# EAGLE design Lapse controller mini, Rev2 (EAGLE 9.4.2)
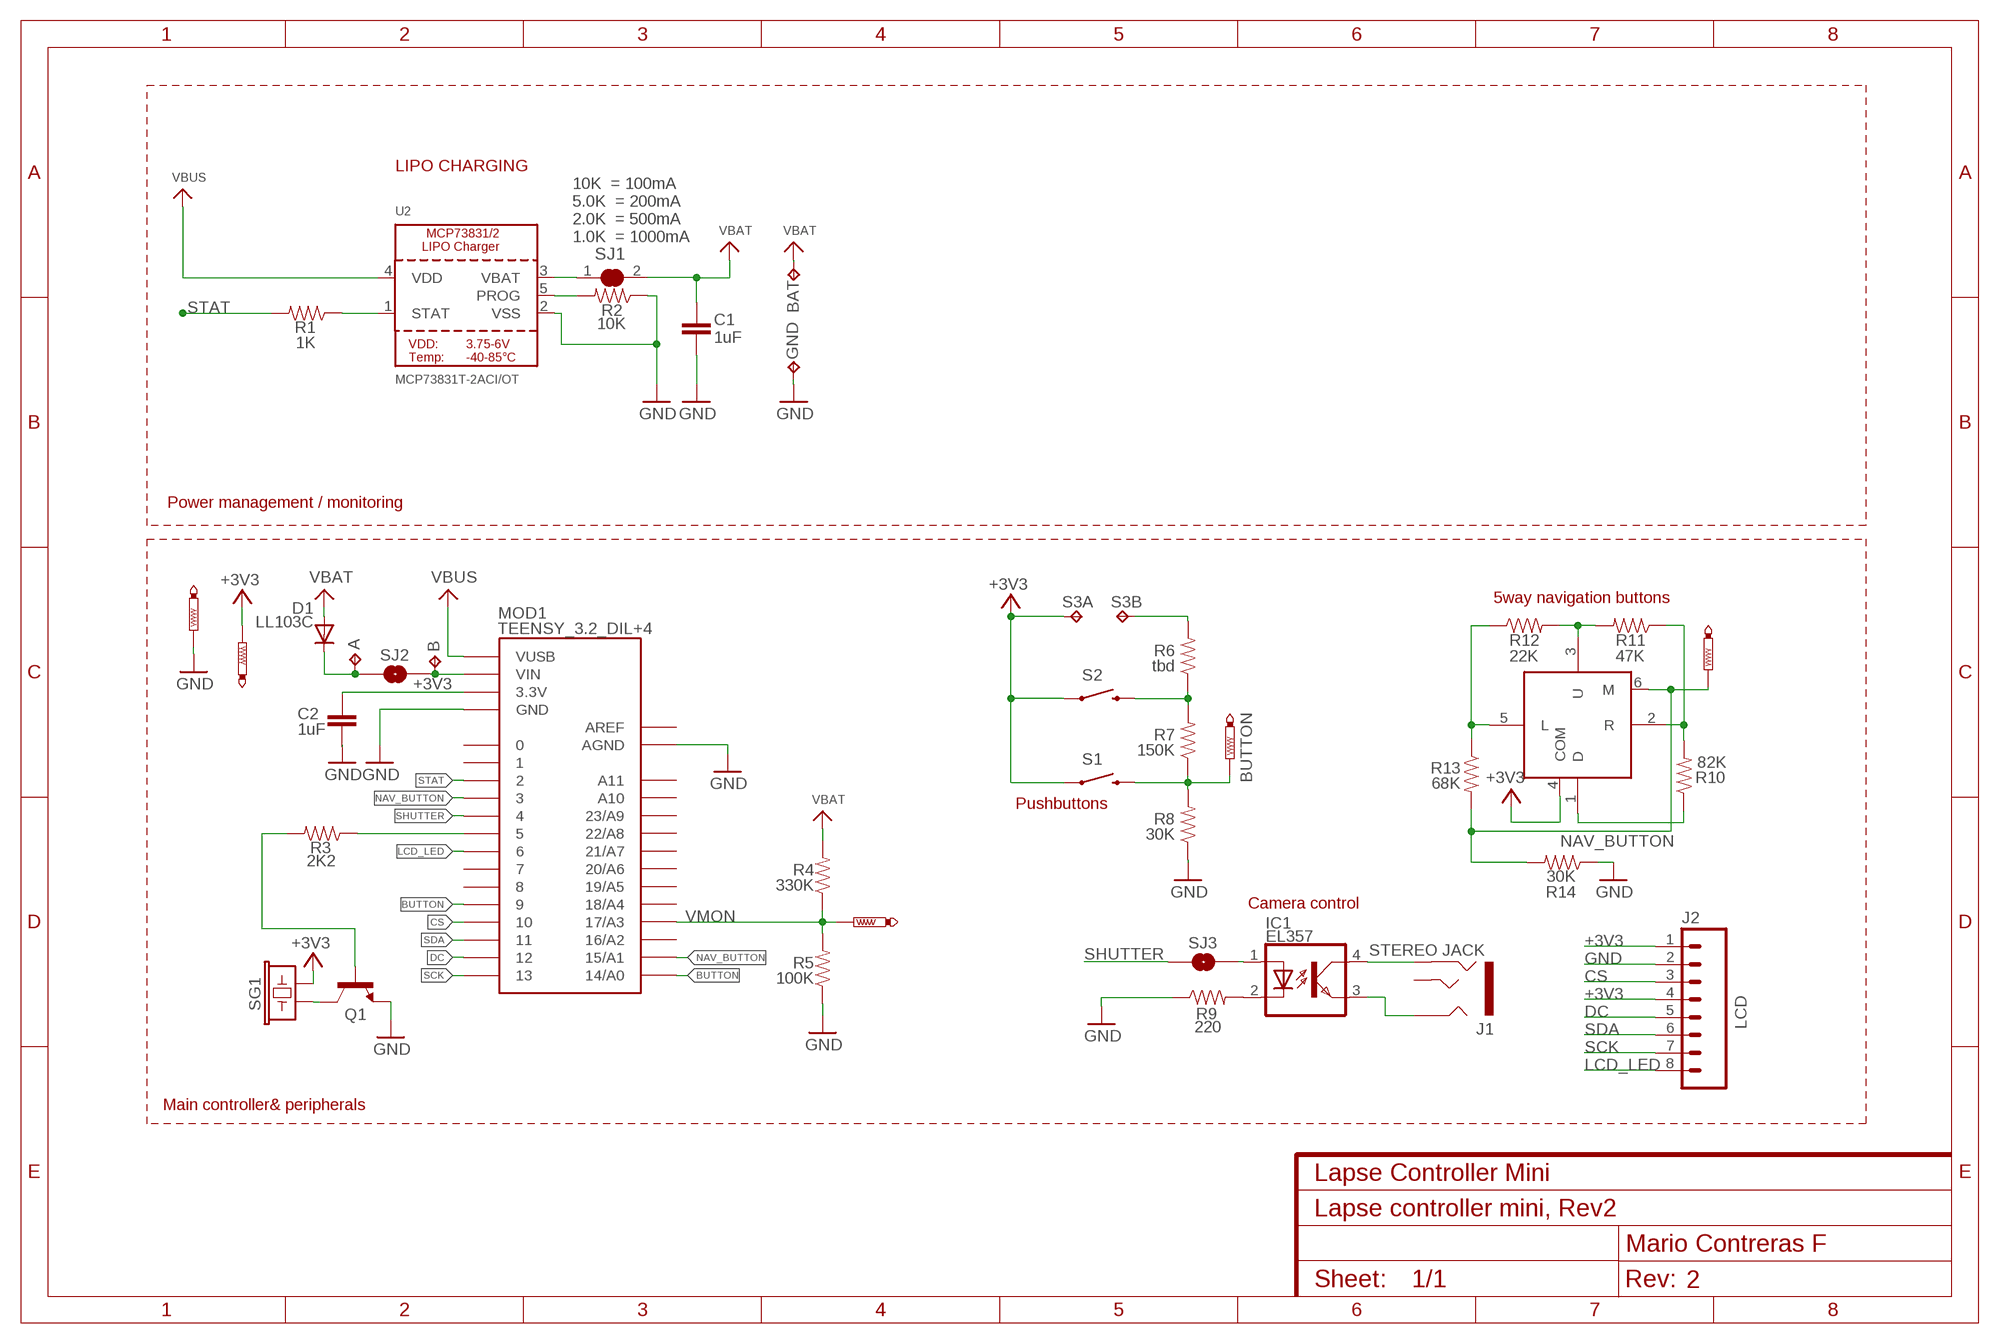
[diagram p0: schematic, sheet 1]
FRAME1 (FRAME-A4L): CNAME: Lapse Controller Mini; CREVISION: 2; DESIGNER: Mario Contreras F

## Parts
3V3  PTR1PAD1-13  [P1-13]
A  TPTP17SQ  [TP17SQ]
B  TPTP17SQ  [TP17SQ]
BAT  VBAT  TPPAD1_B  [P1-PAD_B]
BTN  PTR1PAD1-13  [P1-13]
BUTTONS1  GND  PTR1PAD1-13  [P1-13]
C1  1uF  C-EUC0805K  [C0805K]
C2  1uF  C-EUC0805K  [C0805K]
D1  LL103C  DIODEMINIMELF  [MINIMELF]
GND  GND  TPPAD1_B  [P1-PAD_B]
IC1  EL357  [SOP-4]
J1  STEREO JACK  AUDIO-JACK3  [AUDIO-JACK-TRRS-SMD]
J2  LCD  CONN_08NO_SILK_FEMALE_PTH  [1X08_NO_SILK]
MOD1  TEENSY_3.2_DIL+4  TEENSY_3.0_DIL+4  [TEENSY3-DIL+4]
Q1  TRANSISTOR_NPNSOT23-3  [SOT23-3]
R1  1K  RESISTOR1206  [1206]
R2  10K  RESISTOR1206  [1206]
R3  2K2  RESISTOR1206  [1206]
R4  330K  RESISTOR1206  [1206]
R5  100K  RESISTOR1206  [1206]
R6  tbd  RESISTOR1206  [1206]
R7  150K  RESISTOR1206  [1206]
R8  30K  RESISTOR1206  [1206]
R9  220  RESISTOR1206  [1206]
R10  82K  RESISTOR1206  [1206]
R11  47K  RESISTOR1206  [1206]
R12  22K  RESISTOR1206  [1206]
R13  68K  RESISTOR1206  [1206]
R14  30K  RESISTOR1206  [1206]
S1  MOMENTARY-SWITCH-SPSTTACTILE_SWITCH_PTHA  [TACTILE_SWITCH_PTH]
S2  MOMENTARY-SWITCH-SPSTTACTILE_SWITCH_PTHA  [TACTILE_SWITCH_PTH]
S3A  TPPAD1_B  [P1-PAD_B]
S3B  TPPAD1_B  [P1-PAD_B]
SG1  BUZZERSMD2  [BUZZER-HCS09H]
SJ1  SOLDERJUMPER_CLOSED  [SOLDERJUMPER_CLOSEDWIRE]
SJ2  JUMPER-PAD-2-NO  [PAD-JUMPER-2-NO_NO_SILK]
SJ3  JUMPER-PAD-2-NO  [PAD-JUMPER-2-NO_NO_SILK]
SW1  MICROBUILDER_NAVSWITCH  [MICROBUILDER_SKQUBAE010BB]
U2  MCP73831T-2ACI/OT  MCP73831/2  [SOT23-5]
VM  PTR1PAD1-13  [P1-13]
XY  PTR1PAD1-13  [P1-13]

## Nets
+3V3: 3V3.TP C2.1 J2.1 J2.4 MOD1.3.3V S1.P$1 S2.P$1 S3A.TP SG1.- SW1.4(COM)
BUTTON: BTN.TP MOD1.9 MOD1.14/A0 R7.1 R8.2 S1.P$2
CS: J2.3 MOD1.10
DC: J2.5 MOD1.12
GND: BUTTONS1.TP C1.2 C2.2 GND.TP J2.2 MOD1.AGND MOD1.GND Q1.2(E) R2.1 R5.1 R8.1 R9.1 R14.1 U2.2(VSS)
LCD_LED: J2.8 MOD1.6
N$1: R10.1 SW1.1(D)
N$2: IC1.2(C) R9.2
N$3: A.TP D1.C SJ2.1
N$4: IC1.4(COL) J1.RING2A(RING2) J1.RING2B(RING2)
N$5: IC1.3(EMIT) J1.RING1A(RING1) J1.RING1B(RING1)
N$6: R1.1 U2.1(STAT)
N$7: R2.2 U2.5(PROG)
N$8: SJ1.1 U2.3(VBAT)
N$9: MOD1.5 R3.1
N$10: R10.2 R11.1 SW1.2(R)
N$11: R11.2 R12.2 SW1.3(U)
N$12: R12.1 R13.1 SW1.5(L)
N$13: B.TP MOD1.VIN SJ2.2
N$15: R6.2 S3B.TP
N$18: Q1.1(B) R3.2
N$19: Q1.3(C) SG1.+
N$31: R6.1 R7.2 S2.P$2
NAV_BUTTON: MOD1.3 MOD1.15/A1 R13.2 R14.2 SW1.6(M) XY.TP
SCK: J2.7 MOD1.13
SDA: J2.6 MOD1.11
SHUTTER: MOD1.4 SJ3.1
SHUTTER_A: IC1.1(A) SJ3.2
STAT: MOD1.2 R1.2
VBAT: BAT.TP C1.1 D1.A R4.2 SJ1.2
VBUS: MOD1.VUSB U2.4(VDD)
VMON: MOD1.17/A3 R4.1 R5.2 VM.TP
Unconnected: J1.EARTH1(TIP) J1.EARTH2(TIP) MOD1.0 MOD1.1 MOD1.7 MOD1.8 MOD1.16/A2 MOD1.18/A4 MOD1.19/A5 MOD1.20/A6 MOD1.21/A7 MOD1.22/A8 MOD1.23/A9 MOD1.A10 MOD1.A11

## Notes on the sheet
- LIPO CHARGING
- 10K  = 100mA
- 5.0K  = 200mA
- 2.0K  = 500mA
- 1.0K  = 1000mA
- Power management / monitoring
- 5way navigation buttons
- Pushbuttons
- Camera control
- Main controller& peripherals

## Power pins joined to a net without a drawn wire
AREF: MOD1.AREF

## Library data of the parts
3V3 BTN BUTTONS1 VM XY = testpad:PTR1: TEST PIN
A B BAT GND S3A S3B = bymacf:TP: Test pad
C1 C2 = rcl:C-EU: CAPACITOR, European symbol
D1 = bymacf:DIODE: DIODE
IC1 = bymacf:EL357: SHARP OPTO COUPLER
J1 = bymacf:AUDIO-JACK3: Audio jack - 3.5mm three rings SMD
J2 = SparkFun-Connectors:CONN_08: Multi connection point. Often used as Generic Header-pin footprint for 0.1 inch spaced/style header connections On any of the 0.1 inch spaced packages, you can populate with these: Break Away Headers - Straight <https://www.sparkfun.com/products/116> (PRT-00116) Break Away Male Headers - Right Angle <https://www.sparkfun.com/products/553> (PRT-00553) Female Headers <https://www.sparkfun.com/products/115> (PRT-00115) Break Away Headers - Machine Pin <https://www.sparkfun.com/products/117> (PRT-00117) Break Away Female Headers - Swiss Machine Pin <https://www.sparkfun.com/products/743> (PRT-00743) Arduino Stackable Header - 8 Pin <https://www.sparkfun.com/products/9279> (PRT-09279) For SCREWTERMINALS and SPRING TERMINALS visit here: Screw Terimnals on SparkFun.com <https://www.sparkfun.com/search/results?term=Screw+Terminals> (5mm/3.5mm/2.54mm spacing) This device is also useful as a general connection point to wire up your design to another part of your project. Our various solder wires solder well into these plated through hole pads. Hook-Up Wire - Assortment (Stranded, 22 AWG) <https://www.sparkfun.com/products/11375> (PRT-11375) Hook-Up Wire - Assortment (Solid Core, 22 AWG) <https://www.sparkfun.com/products/11367> (PRT-11367) View the entire wire category on our website here <https://www.sparkfun.com/categories/141> Special notes: Molex polarized connector foot print use with SKU : PRT-08231 with associated crimp pins and housings. 1MM SMD Version SKU: PRT-10208 NOTES ON THE VARIANTS LOCK and LOCK_LONGPADS... This footprint was designed to help hold the alignment of a through-hole component (i.e. 6-pin header) while soldering it into place. You may notice that each hole has been shifted either up or down by 0.005 of an inch from it's more standard position (which is a perfectly straight line). This slight alteration caused the pins (the squares in the middle) to touch the edges of the holes. Because they are alternating, it causes a "brace" to hold the component in place. 0.005 has proven to be the perfect amount of "off-center" position when using our standard breakaway headers. Although looks a little odd when you look at the bare footprint, once you have a header in there, the alteration is very hard to notice. Also,if you push a header all the way into place, it is covered up entirely on the bottom side.; PROD_ID: CONN-08438
MOD1 = Teensy_3_and_LC_Series_Boards_v1.1:TEENSY_3.0_DIL+4: Teensy 3.0 DIL package with 4 inner row pins exposed also.
Q1 = SparkFun-DiscreteSemi:TRANSISTOR_NPN: Generic NPN BJT MMBT2222A - TRANS-08049 (SOT-23, 1A 40V) MPSA42 - TRANS-09116 (SOT-23, 500mA 300V) MMBT5088LT1G - TRANS-11160 (SOT-23, 50 mA 30V) BC547 - COM-08928 <http://www.sparkfun.com/products/8928> (TO-92 45V 100mA) (1.Collector 2.Base 3.Emitter) 2N3904 - COM-00521 <http://www.sparkfun.com/products/521> (TO-92 40V 200mA) (1.Emitter 2.Base 3.Collector) P2N2222A - COM-12852 <http://www.sparkfun.com/products/12852> (TO-92 40V 600mA) (1.Collector 2.Base 3.Emitter); PROD_ID: TRANS-08049
R1-R14 = SparkFun-Passives:RESISTOR: Resistor Basic schematic elements and footprints for 0603, 1206, and PTH resistors.
S1 S2 = bymacf:MOMENTARY-SWITCH-SPST: Momentary Switch (Pushbutton) - SPST Normally-open (NO) SPST momentary switches (buttons, pushbuttons). Variants PTH-12MM - 12mm square, through-hole Momentary Pushbutton Switch - 12mm Square <https://www.sparkfun.com/products/9190> (COM-09190) PTH-6.0MM, PTH-6.0MM-KIT - 6.0mm square, through-hole Mini Pushbutton Switch <https://www.sparkfun.com/products/97> (COM-00097) KIT package intended for soldering kit's - only one side of pads' copper is exposed. PTH-RIGHT-ANGLE-KIT - Right-angle, through-hole Right Angle Tactile Button <https://www.sparkfun.com/products/10791> - Used on SparkFun BigTime Watch Kit <https://www.sparkfun.com/products/11734> SMD-12MM - 12mm square, surface-mount Tactile Button - SMD (12mm) <https://www.sparkfun.com/products/12993> (COM-12993) Used on SparkFun PicoBoard <https://www.sparkfun.com/products/11888> SMD-4.5MM - 4.5mm Square Trackball Switch Used on SparkFun Blackberry Trackballer Breakout <https://www.sparkfun.com/products/13169> SMD-4.6MMX2.8MM - 4.60mm x 2.80mm, surface mount Used on SparkFun SAMD21 Mini Breakout <https://www.sparkfun.com/products/13664> SMD-5.2MM, SMD-5.2-REDUNDANT - 5.2mm square, surface-mount Mini Pushbutton Switch - SMD <https://www.sparkfun.com/products/8720> (COM-08720) Used on Arduino Pro Mini <https://www.sparkfun.com/products/11114> REDUNDANT package connects both switch circuits together SMD-6.0X3.5MM - 6.0 x 3.5mm, surface mount Momentary Reset Switch SMD <https://www.sparkfun.com/products/8229> (COM-08229) SMD-6.2MM-TALL - 6.2mm square, surface mount Tactile Button - SMD (6mm) <https://www.sparkfun.com/products/12992> Used on SparkFun Digital Sandbox <https://www.sparkfun.com/products/12651> SMD-RIGHT-ANGLE - Right-angle, surface mount Used on SparkFun Block for Intel® Edison - Arduino <https://www.sparkfun.com/products/13036>
SG1 = bymacf:BUZZER: Buzzer 12mm Spark Fun Electronics SKU : Comp-Buzzer
SJ1 = microbuilder:SOLDERJUMPER_CLOSED: Solder Jumper - Closed These solder jumpers are closed by default CLOSEDWIRE - 10 mil trace between pads that can be cut and resoldered later CLOSEDPERM - 63 mil trace between pads for a permanent connection (used to 'bridge' two signals, a shameless hack for Eagle). Can double as a test point as well (no cream layer)
SJ2 SJ3 = SparkFun-Passives:JUMPER-PAD-2-NO
SW1 = bymacf:MICROBUILDER_NAVSWITCH
U2 = microbuilder:MCP73831/2: MCP73831/2 LIPO Charger VDD: 3.75 - 6V Temp -40 - 85°C Programmable Charge Rate: 15-500mA NOTE: STAT is a tri-state logic output on the MCP73831 and an open-drain output on the MCP73832. SOT23-5 with 4.2V output and tri-state logic on STAT = MCP73831T-2ACI/OT

## Board
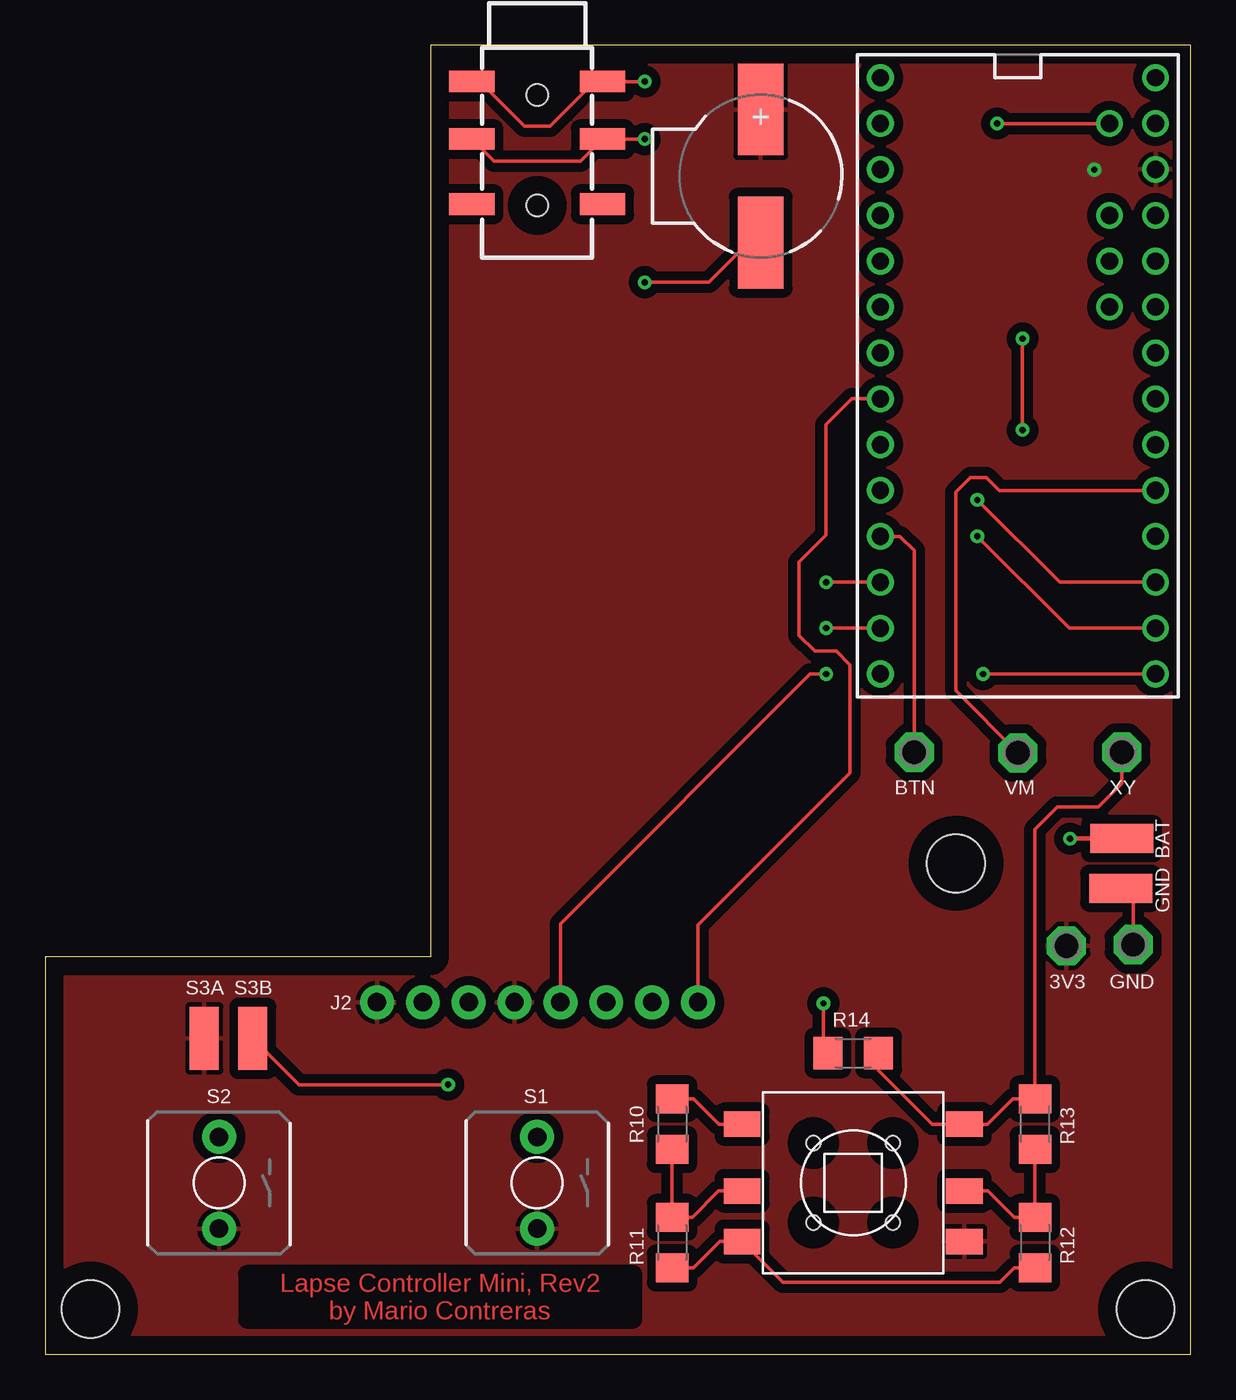
[diagram p1: board, top side]
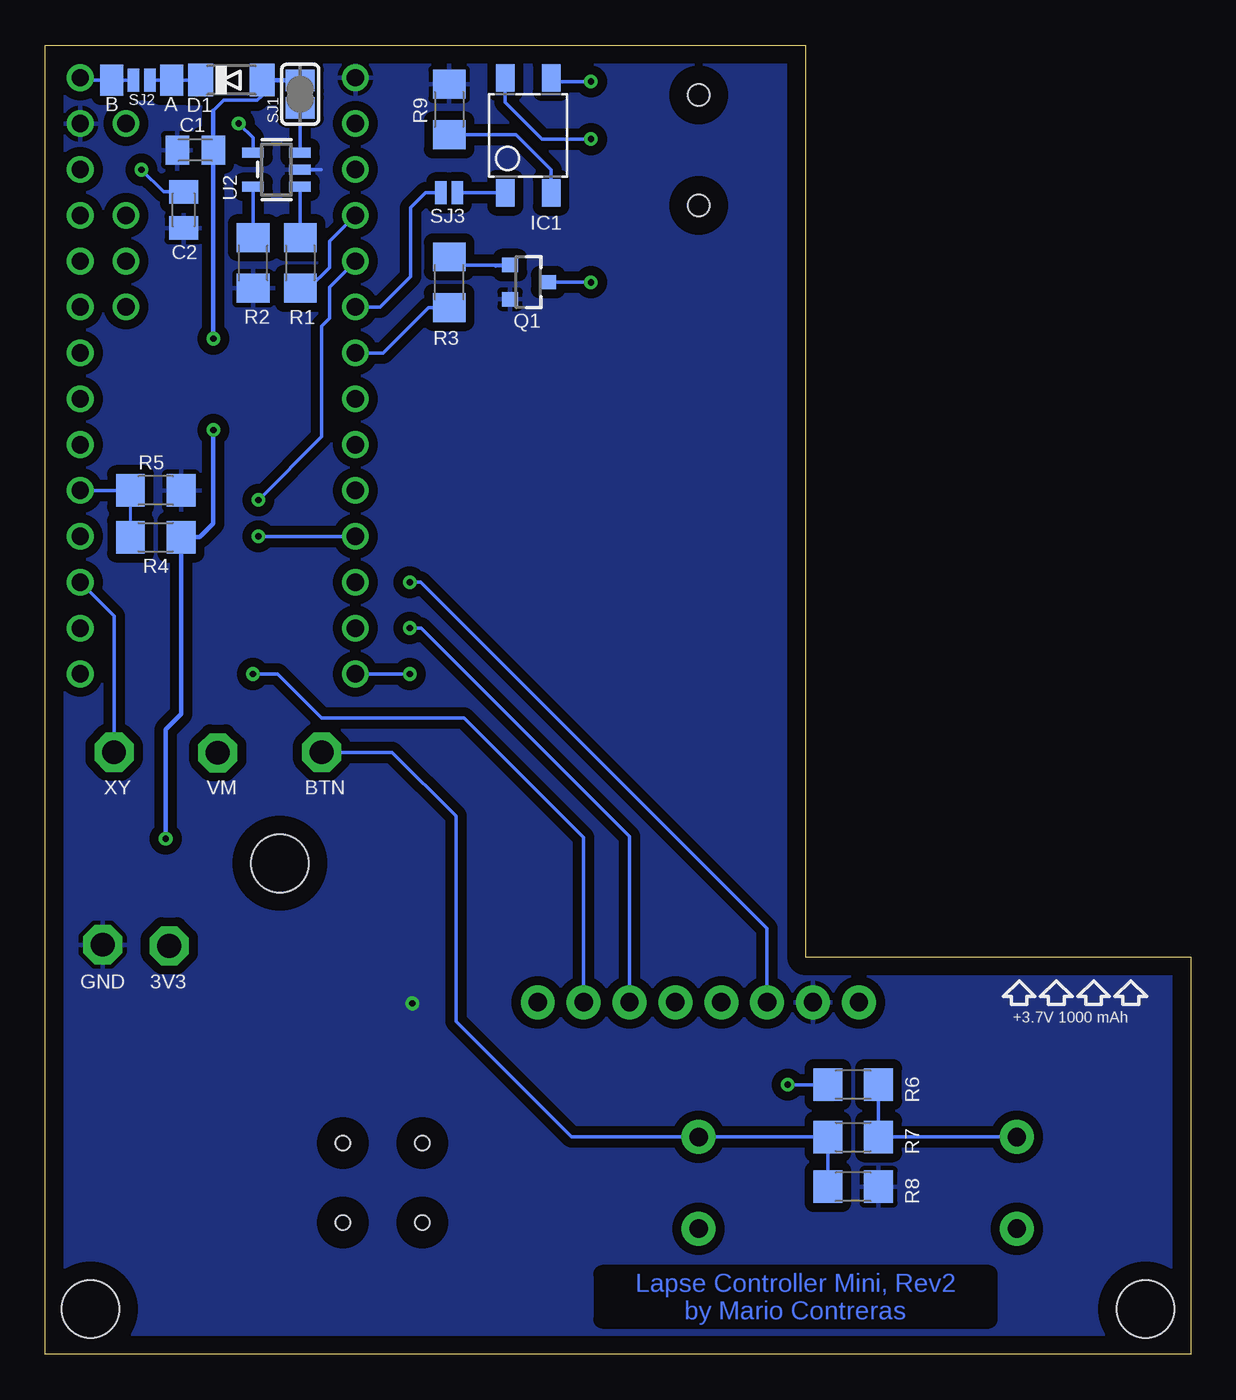
[diagram p2: board, bottom side, seen from below]

Size 63.44 x 72.5 mm. Coordinates in mm from the lower left corner, seen from the top.
Outline: 0,0 63.44,0 63.44,72.5 21.34,72.5 21.34,22 0,22 0,0
Copper layers (1*16): Top 0.035mm / dielectric 1.5mm / Bottom 0.035mm
Design rules "default": minimum track width 6mil, minimum drill 0.35mm, track to track 6mil, track to pad 6mil, pad to pad 6mil, via to via 6mil, smd to smd 6mil, copper to edge 40mil, drill to drill 6mil, minimum pad ring 10mil, minimum via ring 8mil, stop-mask expansion 4mil, vias tented up to drill 0mil, thermal gap 10mil
Holes 3.2 mm at 60.94,2.5 50.44,27.19 2.5,2.5

### Footprints (pad centres in the part's own frame; a part is rotated, then mirrored left to right if it is on the bottom)
P1-13 = drill 1.321 pad 2.159 octagon: TP 0,0
TP17SQ = smd 1.27 x 1.727: TP 0,0
P1-PAD_B = smd 1.6 x 3.5: TP 0,0
C0805K = smd 1.3 x 1.6: 1 -1,0; 2 1,0
MINIMELF = smd 1.4 x 1.8: A 1.7,0; C -1.7,0
SOP-4 = smd 1.524 x 1.016: 1 -3.175,1.27; 2 -3.175,-1.27; 3 3.175,-1.27; 4 3.175,1.27
AUDIO-JACK-TRRS-SMD = smd 1.2 x 2.5: EARTH1 9.995,3.619; EARTH2 9.995,-3.619; RING1A 3.2,3.619; RING1B 3.2,-3.619; RING2A 6.391,3.619; RING2B 6.391,-3.619 | hole 1.2: 3.95,0; 10.06,0
1X08_NO_SILK = drill 1.016 pad 1.88: 1 0,0; 2 2.54,0; 3 5.08,0; 4 7.62,0; 5 10.16,0; 6 12.7,0; 7 15.24,0; 8 17.78,0
TEENSY3-DIL+4 = drill 0.965: 0 -7.62,13.97; 1 -7.62,11.43; 2 -7.62,8.89; 3 -7.62,6.35; 3.3V 7.62,11.43; 4 -7.62,3.81; 5 -7.62,1.27; 6 -7.62,-1.27; 7 -7.62,-3.81; 8 -7.62,-6.35; 9 -7.62,-8.89; 10 -7.62,-11.43; 11 -7.62,-13.97; 12 -7.62,-16.51; 13 7.62,-16.51; 14/A0 7.62,-13.97; 15/A1 7.62,-11.43; 16/A2 7.62,-8.89; 17/A3 7.62,-6.35; 18/A4 7.62,-3.81; 19/A5 7.62,-1.27; 20/A6 7.62,1.27; 21/A7 7.62,3.81; 22/A8 7.62,6.35; 23/A9 7.62,8.89; A10 5.08,6.35; A11 5.08,3.81; AGND 7.62,13.97; AREF 5.08,8.89; GND -7.62,16.51; VIN 7.62,16.51; VUSB 5.08,13.97
SOT23-3 = smd 0.8 x 0.9: 1 -0.95,-1; 2 0.95,-1; 3 0,1.1
1206 = smd 1.6 x 1.8: 1 -1.4,0; 2 1.4,0
TACTILE_SWITCH_PTH = drill 1.016 pad 1.88: P$1 -2.54,0; P$2 2.54,0
BUZZER-HCS09H = smd 5.08 x 2.54: + 3.683,0; - -3.683,0
SOLDERJUMPER_CLOSEDWIRE = smd 1.168 x 1.6: 1 -0.762,0; 2 0.762,0 | smd 0.635 x 0.203: WIRE 0,0
PAD-JUMPER-2-NO_NO_SILK = smd 0.635 x 1.27: 1 -0.45,0; 2 0.45,0
MICROBUILDER_SKQUBAE010BB = smd 2.032 x 1.397: 1 -6.152,3.25 | smd 2.032 x 1.422: 2 -6.152,-0.45; 3 -6.152,-3.25; 4 6.152,-3.25; 5 6.152,-0.45; 6 6.152,3.25 | hole 0.8: -2.2,2.2; 2.2,2.2; 2.2,-2.2; -2.2,-2.2
SOT23-5 = smd 0.55 x 1.2: 1 -0.95,-1.3; 2 0,-1.3; 3 0.95,-1.3; 4 0.95,1.3; 5 -0.95,1.3

### Placement (x,y rotation side)
3V3  56.56,22.62 0 top
A  56.44,70.56 180 bottom
B  59.74,70.56 180 bottom
BAT  59.62,28.56 270 top
BTN  48.12,33.34 0 top
BUTTONS1  60.25,22.69 0 top
C1  55.12,66.69 180 bottom
C2  55.77,63.38 270 bottom
D1  53.12,70.56 0 bottom
GND  59.56,25.81 270 top
IC1  36.69,67.5 90 bottom
J1  27.25,73.69 270 top
J2  18.38,19.5 0 top
MOD1  53.88,54.19 0 top
Q1  36.69,59.38 270 bottom
R1  49.31,60.44 270 bottom
R2  51.92,60.44 90 bottom
R3  41.06,59.38 90 bottom
R4  57.31,45.25 0 bottom
R5  57.31,47.84 180 bottom
R6  18.69,14.94 180 bottom
R7  18.69,12.04 0 bottom
R8  18.69,9.28 180 bottom
R9  41.06,68.94 270 bottom
R10  34.72,12.75 270 top
R11  34.72,6.19 270 top
R12  54.81,6.19 270 top
R13  54.81,12.75 90 top
R14  44.75,16.69 0 top
S1  27.25,9.5 90 top
S2  9.62,9.5 90 top
S3A  8.81,17.5 0 top
S3B  11.5,17.5 0 top
SG1  39.62,65.25 270 top
SJ1  49.31,69.78 90 bottom
SJ2  58.09,70.56 180 bottom
SJ3  41.06,64.33 0 bottom
SW1  44.75,9.5 0 top
U2  50.62,65.61 90 bottom
VM  53.87,33.31 0 top
XY  59.62,33.34 0 top

### Tracks (layer width: path | path; a pad name or v marks a point on that pad's centre or on a via)
+3V3  (via drill 0.35)
  Bottom 0.2: v58.11,65.61 56.88,64.38 C2.1
  pour Top (isolate 0.5): 0,0 63.44,0 63.44,72.5 21.24,72.5 21.24,22 0,22
BUTTON  (via drill 0.35)
  Top 0.2: MOD1.9 47.33,45.3 48.12,44.5 BTN.TP | v51.62,45.3 56.7,40.22 MOD1.14/A0
  Bottom 0.2: v51.62,45.3 MOD1.9 | R8.2 R7.1 S1.P$2 34.29,12.04 40.69,18.44 40.69,29.81 44.22,33.34 BTN.TP
CS  (via drill 0.35)
  Top 0.2: v43.25,42.76 MOD1.10
  Bottom 0.2: v43.25,42.76 42.63,42.76 23.45,23.58 J2.3
DC  (via drill 0.35)
  Top 0.2: J2.5 28.54,23.85 42.37,37.68 v43.25,37.68
  Bottom 0.2: v43.25,37.68 MOD1.12
GND  (via drill 0.35)
  Top 0.2: GND.TP 60.25,25.12 BUTTONS1.TP | v43.1,19.44 43.1,16.69 R14.1
  Bottom 0.2: U2.2 48.14,65.61
  pour Bottom (isolate 0.5): 0,0 63.44,0 63.44,72.5 21.24,72.5 21.24,22 0,22
LCD_LED
  Top 0.2: J2.8 36.16,23.78 44.56,32.19 44.56,38.19 43.81,38.94 42.62,38.94 41.75,39.81 41.75,43.88 43.25,45.38 43.25,51.5 44.67,52.92 MOD1.6
N$1
  Top 0.2: SW1.1 37.31,12.75 35.91,14.15 R10.1
N$2
  Bottom 0.2: R9.2 37.35,67.54 35.42,65.61 IC1.2
N$3
  Bottom 0.2: D1.C A.TP SJ2.1
N$4  (via drill 0.35)
  Top 0.2: v33.21,67.3 J1.RING2A 29.64,66.06 24.86,66.06 J1.RING2B
  Bottom 0.2: IC1.4 37.96,69.33 35.92,67.3 v33.21,67.3
N$5  (via drill 0.35)
  Top 0.2: v33.21,70.49 J1.RING1A 30.43,70.49 27.96,68.02 26.54,68.02 24.07,70.49 J1.RING1B
  Bottom 0.2: IC1.3 35.24,70.49 v33.21,70.49
N$6
  Bottom 0.2: U2.1 49.33,61.85 R1.1
N$7
  Bottom 0.2: U2.5 R2.2
N$8
  Bottom 0.2: SJ1.1 U2.3
N$9
  Bottom 0.2: R3.1 42.21,57.98 44.73,55.46 MOD1.5
N$10
  Top 0.2: SW1.2 37.3,9.05 35.84,7.59 R11.1 R10.2
N$11
  Top 0.2: R11.2 35.91,4.79 37.38,6.25 SW1.3 40.85,4 52.88,4 53.66,4.79 R12.2
N$12
  Top 0.2: SW1.5 52.2,9.05 53.66,7.59 R12.1 R13.1
N$13
  Bottom 0.2: SJ2.2 B.TP 61.36,70.56 MOD1.VIN
N$15  (via drill 0.35)
  Top 0.2: S3B.TP 14.06,14.94 v22.31,14.94
  Bottom 0.2: v22.31,14.94 R6.2
N$18
  Bottom 0.2: 38.5,60.26 Q1.1 40.39,60.33 R3.2
N$19  (via drill 0.35)
  Top 0.2: SG1.+ 38.94,61.57 36.75,59.38 34.82,59.38 v33.21,59.37
  Bottom 0.2: v33.21,59.37 35.65,59.37 Q1.3
N$31
  Bottom 0.2: S2.P$2 R7.2 R6.1
NAV_BUTTON  (via drill 0.35)
  Top 0.2: v51.62,47.31 56.18,42.76 MOD1.15/A1 | R14.2 46.15,15.72 49.12,12.75 SW1.6 52.19,12.75 53.59,14.15 R13.2 54.81,29.06 56.06,30.31 58.31,30.31 59.62,31.62 XY.TP
  Bottom 0.2: v51.62,47.31 48.12,50.81 48.12,56.94 47.69,57.38 47.69,59.1 MOD1.3 | MOD1.15/A1 59.62,40.89 XY.TP | XY.TP
SCK  (via drill 0.35)
  Top 0.2: v51.94,37.68 MOD1.13
  Bottom 0.2: v51.94,37.68 50.55,37.68 48.12,35.25 40.25,35.25 33.62,28.61 J2.7
SDA  (via drill 0.35)
  Top 0.2: MOD1.11 v43.25,40.22
  Bottom 0.2: v43.25,40.22 42.62,40.22 31.07,28.67 J2.6
SHUTTER
  Bottom 0.2: MOD1.4 44.88,58 43.19,59.69 43.19,63.5 42.36,64.33 SJ3.1
SHUTTER_A
  Bottom 0.2: IC1.1 SJ3.2
STAT
  Bottom 0.2: MOD1.2 47.69,61.65 47.69,60.19 48.84,59.04 R1.2
VBAT  (via drill 0.35)
  Top 0.2: v54.12,56.25 v54.12,51.19
  Top 0.254: v56.76,28.56 BAT.TP
  Bottom 0.2: 49.33,70.56 SJ1.2 | D1.A 51.42,69.7 51.69,69.44 53.55,69.44 54.12,68.86
  Bottom 0.254: D1.A 49.33,70.56 | 54.12,68.86 C1.1 v54.12,56.25 | R4.2 54.88,45.25 54.12,46 v54.12,51.19 | 56.06,45.1 R4.2 | R4.2 55.91,35.46 56.76,34.62 v56.76,28.56
VBUS  (via drill 0.35)
  Top 0.2: MOD1.VUSB v52.72,68.16
  Bottom 0.2: U2.4 51.92,67.36 v52.72,68.16
VMON
  Top 0.2: MOD1.17/A3 52.85,47.84 52.12,48.56 51.25,48.56 50.44,47.75 50.44,36.75 VM.TP
  Bottom 0.152: R4.1 R5.2
  Bottom 0.2: R5.2 MOD1.17/A3

### Text on the board
Top: Lapse Controller Mini, Rev2 / by Mario Contreras
Bottom: Lapse Controller Mini, Rev2 / by Mario Contreras
bNames: BTN | VM | XY | 3V3 | GND | +3.7V 1000 mAh